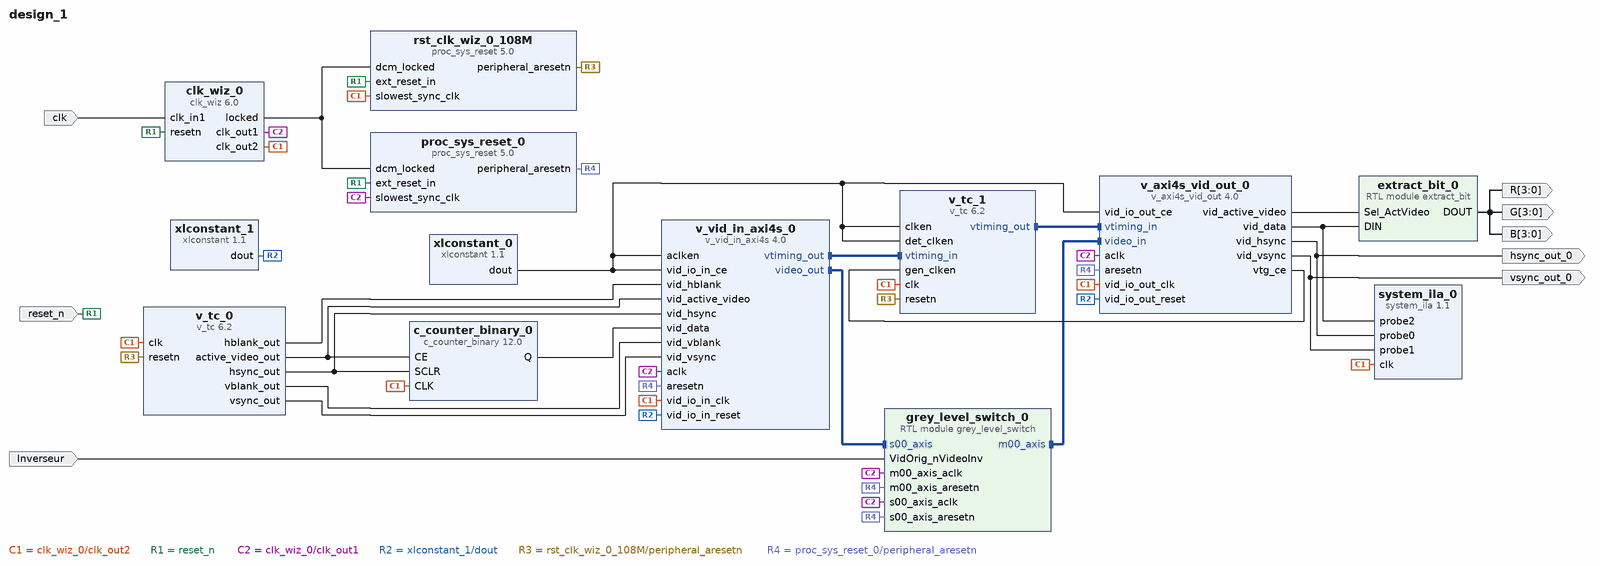
[diagram p0: block diagram of the top level]
# Vivado block design design_1, xc7z020clg484-1, Vivado 2020.1
create_bd_design design_1

create_bd_port -dir I -type clk clk
set_property -dict {CONFIG.FREQ_HZ 100000000 CONFIG.PHASE 0.000} [get_bd_ports clk]
create_bd_port -dir I -type rst reset_n
set_property -dict {CONFIG.POLARITY ACTIVE_LOW} [get_bd_ports reset_n]
create_bd_port -dir O hsync_out_0
create_bd_port -dir O vsync_out_0
create_bd_port -dir O -from 3 -to 0 R
create_bd_port -dir O -from 3 -to 0 G
create_bd_port -dir O -from 3 -to 0 B
create_bd_port -dir I Inverseur

create_bd_cell -type ip -vlnv xilinx.com:ip:clk_wiz:6.0 clk_wiz_0
set_property -dict [list \
  CONFIG.CLKIN1_JITTER_PS 100.0 \
  CONFIG.CLKOUT1_JITTER 114.767 \
  CONFIG.CLKOUT1_PHASE_ERROR 87.466 \
  CONFIG.CLKOUT1_REQUESTED_OUT_FREQ 108.000 \
  CONFIG.CLKOUT2_JITTER 155.403 \
  CONFIG.CLKOUT2_PHASE_ERROR 87.466 \
  CONFIG.CLKOUT2_REQUESTED_OUT_FREQ 25.2 \
  CONFIG.CLKOUT2_USED true \
  CONFIG.CLK_IN1_BOARD_INTERFACE sys_clock \
  CONFIG.ENABLE_CLOCK_MONITOR false \
  CONFIG.MMCM_CLKFBOUT_MULT_F 11.875 \
  CONFIG.MMCM_CLKIN1_PERIOD 10.000 \
  CONFIG.MMCM_CLKOUT0_DIVIDE_F 11.000 \
  CONFIG.MMCM_CLKOUT1_DIVIDE 47 \
  CONFIG.MMCM_DIVCLK_DIVIDE 1 \
  CONFIG.NUM_OUT_CLKS 2 \
  CONFIG.PRIMITIVE MMCM \
  CONFIG.RESET_PORT resetn \
  CONFIG.RESET_TYPE ACTIVE_LOW \
  CONFIG.USE_BOARD_FLOW true \
  CONFIG.USE_LOCKED true \
] [get_bd_cells clk_wiz_0]
create_bd_cell -type ip -vlnv xilinx.com:ip:c_counter_binary:12.0 c_counter_binary_0
set_property -dict {CONFIG.CE true CONFIG.Output_Width 8 CONFIG.SCLR true} [get_bd_cells c_counter_binary_0]
create_bd_cell -type ip -vlnv xilinx.com:ip:proc_sys_reset:5.0 rst_clk_wiz_0_108M
create_bd_cell -type ip -vlnv xilinx.com:ip:v_tc:6.2 v_tc_0
set_property -dict {CONFIG.HAS_AXI4_LITE false CONFIG.VIDEO_MODE 480p CONFIG.enable_detection false} [get_bd_cells v_tc_0]
create_bd_cell -type module -reference extract_bit extract_bit_0
create_bd_cell -type ip -vlnv xilinx.com:ip:system_ila:1.1 system_ila_0
set_property -dict [list \
  CONFIG.C_ADV_TRIGGER true \
  CONFIG.C_DATA_DEPTH 2048 \
  CONFIG.C_MON_TYPE NATIVE \
  CONFIG.C_NUM_OF_PROBES 3 \
  CONFIG.C_PROBE0_TYPE 0 \
  CONFIG.C_PROBE1_TYPE 0 \
  CONFIG.C_PROBE2_TYPE 0 \
  CONFIG.C_PROBE3_TYPE 0 \
  CONFIG.C_PROBE4_TYPE 0 \
] [get_bd_cells system_ila_0]
create_bd_cell -type ip -vlnv xilinx.com:ip:v_vid_in_axi4s:4.0 v_vid_in_axi4s_0
set_property -dict {CONFIG.C_HAS_ASYNC_CLK 1 CONFIG.C_M_AXIS_VIDEO_FORMAT 12} [get_bd_cells v_vid_in_axi4s_0]
create_bd_cell -type ip -vlnv xilinx.com:ip:v_tc:6.2 v_tc_1
set_property -dict {CONFIG.HAS_AXI4_LITE false CONFIG.VIDEO_MODE 480p CONFIG.auto_generation_mode true} [get_bd_cells v_tc_1]
create_bd_cell -type ip -vlnv xilinx.com:ip:v_axi4s_vid_out:4.0 v_axi4s_vid_out_0
set_property -dict [list \
  CONFIG.C_ADDR_WIDTH 11 \
  CONFIG.C_HAS_ASYNC_CLK 1 \
  CONFIG.C_S_AXIS_VIDEO_FORMAT 12 \
] [get_bd_cells v_axi4s_vid_out_0]
create_bd_cell -type ip -vlnv xilinx.com:ip:xlconstant:1.1 xlconstant_0
create_bd_cell -type ip -vlnv xilinx.com:ip:xlconstant:1.1 xlconstant_1
create_bd_cell -type ip -vlnv xilinx.com:ip:proc_sys_reset:5.0 proc_sys_reset_0
create_bd_cell -type module -reference grey_level_switch grey_level_switch_0

# ---- connections ----

connect_bd_intf_net [get_bd_intf_pins v_vid_in_axi4s_0/vtiming_out] [get_bd_intf_pins v_tc_1/vtiming_in]
connect_bd_intf_net [get_bd_intf_pins v_tc_1/vtiming_out] [get_bd_intf_pins v_axi4s_vid_out_0/vtiming_in]
connect_bd_intf_net [get_bd_intf_pins grey_level_switch_0/m00_axis] [get_bd_intf_pins v_axi4s_vid_out_0/video_in]
connect_bd_intf_net [get_bd_intf_pins v_vid_in_axi4s_0/video_out] [get_bd_intf_pins grey_level_switch_0/s00_axis]
connect_bd_net -net sys_clock_1 [get_bd_ports clk] [get_bd_pins clk_wiz_0/clk_in1]
connect_bd_net [get_bd_pins clk_wiz_0/locked] [get_bd_pins rst_clk_wiz_0_108M/dcm_locked] [get_bd_pins proc_sys_reset_0/dcm_locked]
connect_bd_net [get_bd_pins clk_wiz_0/clk_out2] \
  [get_bd_pins c_counter_binary_0/CLK] [get_bd_pins rst_clk_wiz_0_108M/slowest_sync_clk] [get_bd_pins v_tc_0/clk] \
  [get_bd_pins system_ila_0/clk] [get_bd_pins v_vid_in_axi4s_0/vid_io_in_clk] [get_bd_pins v_tc_1/clk] \
  [get_bd_pins v_axi4s_vid_out_0/vid_io_out_clk]
connect_bd_net -net reset_rtl_1 [get_bd_ports reset_n] \
  [get_bd_pins clk_wiz_0/resetn] [get_bd_pins rst_clk_wiz_0_108M/ext_reset_in] [get_bd_pins proc_sys_reset_0/ext_reset_in]
connect_bd_net [get_bd_pins extract_bit_0/DOUT] [get_bd_ports B] [get_bd_ports G] [get_bd_ports R]
connect_bd_net [get_bd_pins clk_wiz_0/clk_out1] \
  [get_bd_pins proc_sys_reset_0/slowest_sync_clk] [get_bd_pins v_vid_in_axi4s_0/aclk] [get_bd_pins v_axi4s_vid_out_0/aclk] \
  [get_bd_pins grey_level_switch_0/m00_axis_aclk] [get_bd_pins grey_level_switch_0/s00_axis_aclk]
connect_bd_net [get_bd_pins v_tc_0/hblank_out] [get_bd_pins v_vid_in_axi4s_0/vid_hblank]
connect_bd_net [get_bd_pins xlconstant_0/dout] \
  [get_bd_pins v_vid_in_axi4s_0/vid_io_in_ce] [get_bd_pins v_vid_in_axi4s_0/aclken] [get_bd_pins v_tc_1/clken] \
  [get_bd_pins v_tc_1/det_clken] [get_bd_pins v_axi4s_vid_out_0/vid_io_out_ce]
connect_bd_net [get_bd_pins xlconstant_1/dout] [get_bd_pins v_vid_in_axi4s_0/vid_io_in_reset] [get_bd_pins v_axi4s_vid_out_0/vid_io_out_reset]
connect_bd_net [get_bd_pins v_axi4s_vid_out_0/vtg_ce] [get_bd_pins v_tc_1/gen_clken]
connect_bd_net [get_bd_pins rst_clk_wiz_0_108M/peripheral_aresetn] [get_bd_pins v_tc_1/resetn] [get_bd_pins v_tc_0/resetn]
connect_bd_net [get_bd_pins v_tc_0/active_video_out] [get_bd_pins v_vid_in_axi4s_0/vid_active_video] [get_bd_pins c_counter_binary_0/CE]
connect_bd_net [get_bd_pins v_axi4s_vid_out_0/vid_active_video] [get_bd_pins extract_bit_0/Sel_ActVideo]
connect_bd_net [get_bd_pins c_counter_binary_0/Q] [get_bd_pins v_vid_in_axi4s_0/vid_data]
connect_bd_net -net v_axi4s_vid_out_0_vid_data [get_bd_pins v_axi4s_vid_out_0/vid_data] \
  [get_bd_pins extract_bit_0/DIN] [get_bd_pins system_ila_0/probe2]
connect_bd_net [get_bd_pins v_tc_0/vblank_out] [get_bd_pins v_vid_in_axi4s_0/vid_vblank]
connect_bd_net [get_bd_pins v_tc_0/hsync_out] [get_bd_pins v_vid_in_axi4s_0/vid_hsync] [get_bd_pins c_counter_binary_0/SCLR]
connect_bd_net [get_bd_pins v_axi4s_vid_out_0/vid_hsync] [get_bd_ports hsync_out_0] [get_bd_pins system_ila_0/probe0]
connect_bd_net [get_bd_pins v_tc_0/vsync_out] [get_bd_pins v_vid_in_axi4s_0/vid_vsync]
connect_bd_net [get_bd_pins v_axi4s_vid_out_0/vid_vsync] [get_bd_ports vsync_out_0] [get_bd_pins system_ila_0/probe1]
connect_bd_net [get_bd_ports Inverseur] [get_bd_pins grey_level_switch_0/VidOrig_nVideoInv]
connect_bd_net [get_bd_pins proc_sys_reset_0/peripheral_aresetn] \
  [get_bd_pins v_vid_in_axi4s_0/aresetn] [get_bd_pins v_axi4s_vid_out_0/aresetn] \
  [get_bd_pins grey_level_switch_0/m00_axis_aresetn] [get_bd_pins grey_level_switch_0/s00_axis_aresetn]
set_property HDL_ATTRIBUTE.DEBUG true [get_bd_nets v_axi4s_vid_out_0_vid_data]
set_property HDL_ATTRIBUTE.MARK_DEBUG true [get_bd_nets v_axi4s_vid_out_0_vid_data]

validate_bd_design
save_bd_design
